# EAGLE design slab-aux-pcb (EAGLE 9.6.2)
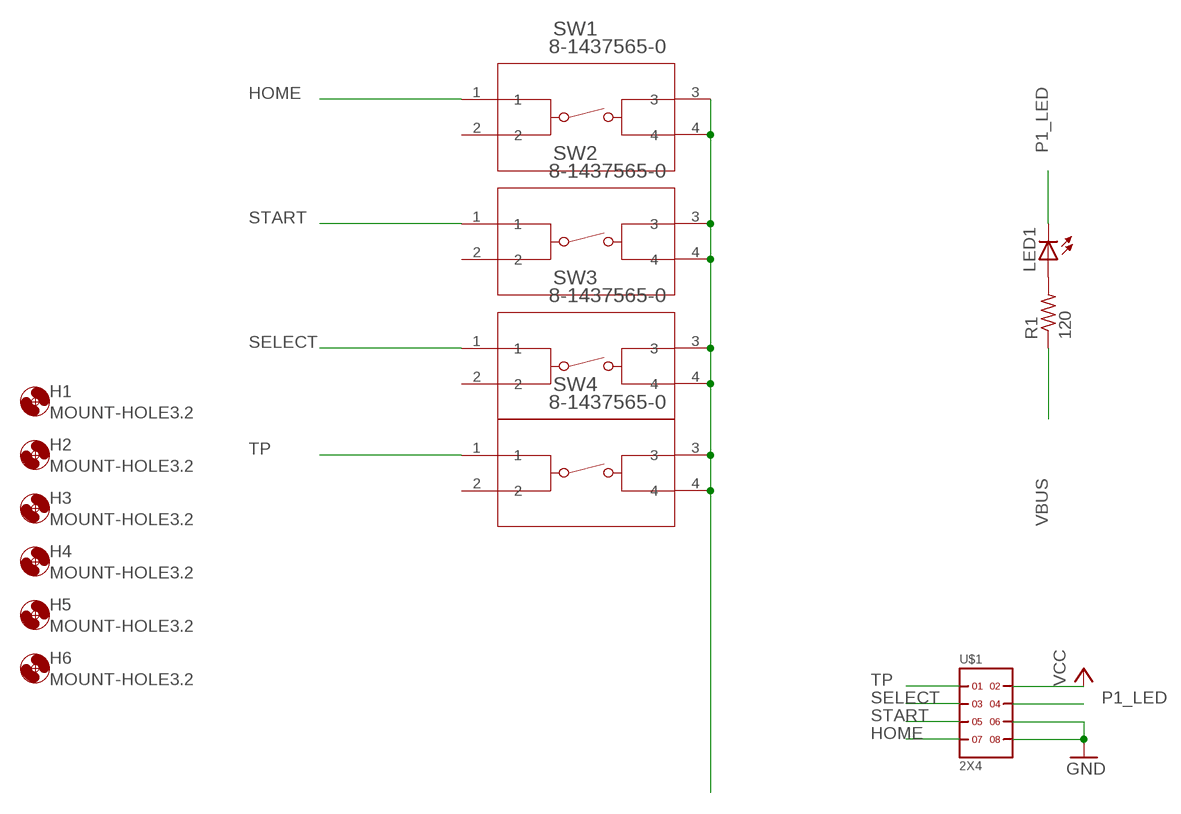
[diagram p0: schematic, sheet 1]

## Parts
H1  MOUNT-HOLE3.2  [3,2]
H2  MOUNT-HOLE3.2  [3,2]
H3  MOUNT-HOLE3.2  [3,2]
H4  MOUNT-HOLE3.2  [3,2]
H5  MOUNT-HOLE3.2  [3,2]
H6  MOUNT-HOLE3.2  [3,2]
LED1  LEDCHIP-LED0603  [CHIP-LED0603]
R1  120  R-US_R0603  [R0603]
SW1  8-1437565-0  [SW4_1437565]
SW2  8-1437565-0  [SW4_1437565]
SW3  8-1437565-0  [SW4_1437565]
SW4  8-1437565-0  [SW4_1437565]
U$1  2X4  [2X4]

## Nets
GND: SW1.3 SW1.4 SW2.3 SW2.4 SW3.3 SW3.4 SW4.3 SW4.4 U$1.6 U$1.8
HOME: SW1.1 U$1.7
N$1: LED1.A R1.2
P1_LED: LED1.C U$1.4
SELECT: SW3.1 U$1.3
START: SW2.1 U$1.5
TP: SW4.1 U$1.1
VBUS: R1.1 U$1.2 ; supply symbol labelled VCC
Unconnected: SW1.2 SW2.2 SW3.2 SW4.2

## Library data of the parts
H1-H6 = holes:MOUNT-HOLE: MOUNTING HOLE with drill center marker
LED1 = adafruit:LED: LED OSRAM: - CHIPLED LG R971, LG N971, LY N971, LG Q971, LY Q971, LO R971, LY R971 LH N974, LH R974 LS Q976, LO Q976, LY Q976 LO Q996 - Hyper CHIPLED LW Q18S LB Q993, LB Q99A, LB R99A - SideLED LS A670, LO A670, LY A670, LG A670, LP A670 LB A673, LV A673, LT A673, LW A673 LH A674 LY A675 LS A676, LA A676, LO A676, LY A676, LW A676 LS A679, LY A679, LG A679 - Hyper Micro SIDELED® LS Y876, LA Y876, LO Y876, LY Y876 LT Y87S - SmartLED LW L88C, LW L88S LB L89C, LB L89S, LG L890 LS L89K, LO L89K, LY L89K LS L896, LA L896, LO L896, LY L896 - TOPLED LS T670, LO T670, LY T670, LG T670, LP T670 LSG T670, LSP T670, LSY T670, LOP T670, LYG T670 LG T671, LOG T671, LSG T671 LB T673, LV T673, LT T673, LW T673 LH T674 LS T676, LA T676, LO T676, LY T676, LB T676, LH T676, LSB T676, LW T676 LB T67C, LV T67C, LT T67C, LS T67K, LO T67K, LY T67K, LW E67C LS E67B, LA E67B, LO E67B, LY E67B, LB E67C, LV E67C, LT E67C LW T67C LS T679, LY T679, LG T679 LS T770, LO T770, LY T770, LG T770, LP T770 LB T773, LV T773, LT T773, LW T773 LH T774 LS E675, LA E675, LY E675, LS T675 LS T776, LA T776, LO T776, LY T776, LB T776 LHGB T686 LT T68C, LB T68C - Hyper Mini TOPLED® LB M676 - Mini TOPLED Santana® LG M470 LS M47K, LO M47K, LY M47K Source: http://www.osram.convergy.de/
R1 = rcl:R-US_: RESISTOR, American symbol; SPICEPREFIX: R
SW1-SW4 = Switches:8-1437565-0; BUILT_BY: EMA_UL_Team; CATEGORY: Tactile Switches; CONFIGURATION__POLE-THROW_: Single Pole - Single Throw; COPYRIGHT: Copyright (C) 2016 Accelerated Designs. All rights reserved; DESCRIPTION: FSMCTTR=TACTILE SWITCH T&R; MANUFACTURER_PART_NUMBER: 8-1437565-0; MAX_SWITCHING_CURRENT: -; MAX_SWITCHING_VOLTAGE_AC_: -; PART_STATUS: active; PRODUCT_TYPE: Switch; SERIES: Unknown; SWITCH_TYPE: Tactile Switches; TE_PART_NUMBER: 8-1437565-0; VENDOR: TE Connectivity
U$1 = headers(2mm)(samtec):2X4

## Board
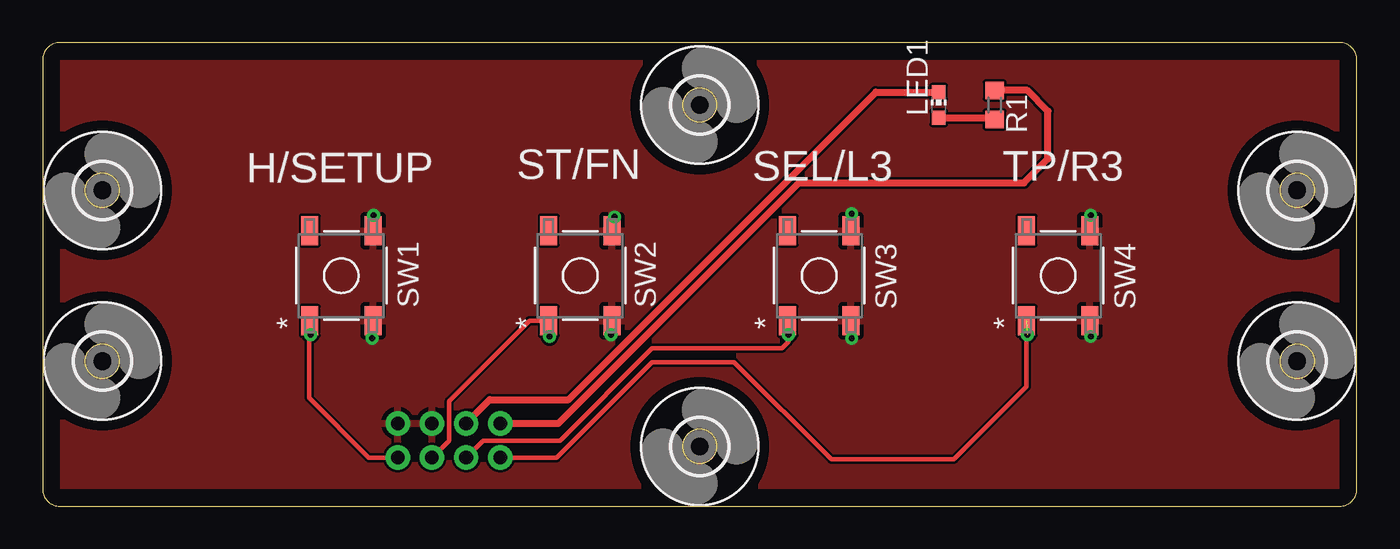
[diagram p1: board, top side]
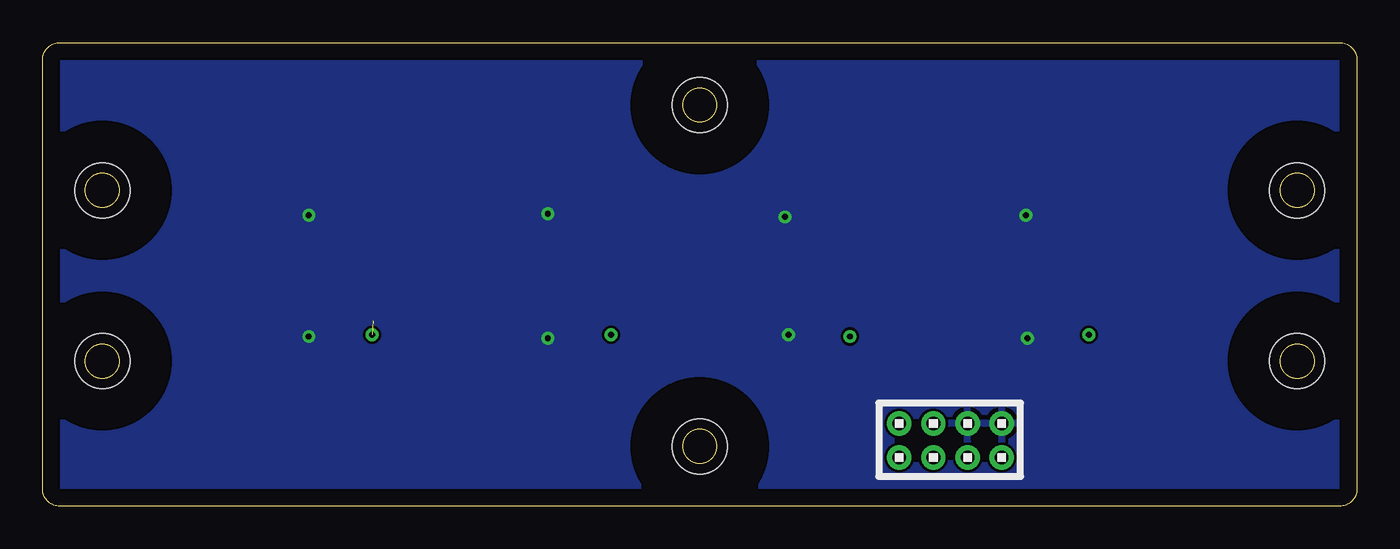
[diagram p2: board, bottom side, seen from below]

Size 77 x 27.15 mm. Coordinates in mm from the lower left corner, seen from the top.
Outline: 77,1 77,26.15 arc90 76,27.15 1,27.15 arc90 0,26.15 0,1 arc90 1,0 76,0 arc90 77,1
Outline: circle at 38.5,3.5 radius 1
Outline: circle at 73.5,8.5 radius 1
Outline: circle at 38.5,23.5 radius 1
Outline: circle at 3.5,18.5 radius 1
Outline: circle at 3.5,8.5 radius 1
Outline: circle at 73.5,18.5 radius 1
Copper layers (1*16): Top 0.035mm / dielectric 1.5mm / Bottom 0.035mm
Design rules "default": minimum track width 6mil, minimum drill 0.35mm, track to track 6mil, track to pad 6mil, pad to pad 6mil, via to via 6mil, smd to smd 6mil, copper to edge 40mil, drill to drill 6mil, minimum pad ring 10mil, minimum via ring 8mil, stop-mask expansion 4mil, vias tented up to drill 0mil, thermal gap 10mil

### Footprints (pad centres in the part's own frame; a part is rotated, then mirrored left to right if it is on the bottom)
3,2 = hole 3.2: 0,0
CHIP-LED0603 = smd 0.8 x 0.8: A 0,-0.75; C 0,0.75
R0603 = smd 1 x 1.1: 1 -0.85,0; 2 0.85,0
SW4_1437565 = smd 1.702 x 0.991: 1 -2.642,1.85; 2 2.642,1.85; 3 -2.642,-1.85; 4 2.642,-1.85
2X4 = drill 0.8 pad 1.422: 1 0,0; 2 0,2; 3 2,0; 4 2,2; 5 4,0; 6 4,2; 7 6,0; 8 6,2

### Placement (x,y rotation side)
H1  3.5,18.5 0 top
H2  3.5,8.5 0 top
H3  38.5,23.5 0 top
H4  38.5,3.5 0 top
H5  73.5,18.5 0 top
H6  73.5,8.5 0 top
LED1  52.5,23.5 0 top
R1  55.78,23.5 270 top
SW1  17.5,13.5 90 top
SW2  31.5,13.5 90 top
SW3  45.5,13.5 90 top
SW4  59.5,13.5 90 top
U$1  26.81,2.85 0 bottom

### Tracks (layer width: path | path; a pad name or v marks a point on that pad's centre or on a via)
GND  (via drill 0.35)
  other vias: 61.4,9.94 61.4,17.04 47.4,17.14 47.4,9.84 33.3,10.04 33.5,16.94 19.4,17.04 19.3,9.84
  pour Top: -0.1,-0.63 -0.1,27.31 77.37,27.31 77.37,-0.63
  pour Bottom: 0.2,-0.56 0.2,27.1 arc45 0.1,27.34 77.3,27.34 77.3,-0.36 77.4,-0.46 0.3,-0.46
HOME  (via drill 0.35)
  Top 0.254: U$1.7 19.09,2.85 15.6,6.34 15.6,10.81 SW1.1
  Top 0.406: SW1.1 15.65,10.09 v15.7,10.04
N$1
  Top 0.406: LED1.A 55.68,22.75 R1.2
P1_LED
  Top 0.406: U$1.4 26.2,6.24 30.81,6.24 48.82,24.25 LED1.C
SELECT  (via drill 0.35)
  Top 0.254: U$1.3 25.8,3.84 27.22,3.84 30.3,3.84 35.7,9.24 43.3,9.24 43.7,9.64 v43.7,10.04 43.7,10.81 SW3.1
START  (via drill 0.35)
  Top 0.254: U$1.5 23.8,3.85 23.8,6.14 28.52,10.86 SW2.1
  Top 0.406: v29.7,9.94 29.65,9.99 SW2.1
TP  (via drill 0.35)  (1 unrouted)
  Top 0.254: U$1.1 30.11,2.85 35.7,8.44 40.5,8.44 46.2,2.74 53.4,2.74 57.65,6.99 57.65,9.94
  Top 0.406: SW4.1 57.65,9.94
  other vias: 57.7,10.04
VBUS
  Top 0.406: U$1.2 30.21,4.85 44.3,18.94 57.5,18.94 58.9,20.34 58.9,23.14 57.69,24.35 R1.1

### Text on the board
tNames: H/SETUP | ST/FN | SEL/L3 | TP/R3